# EAGLE design Cartemoteur (EAGLE 9.4.2)
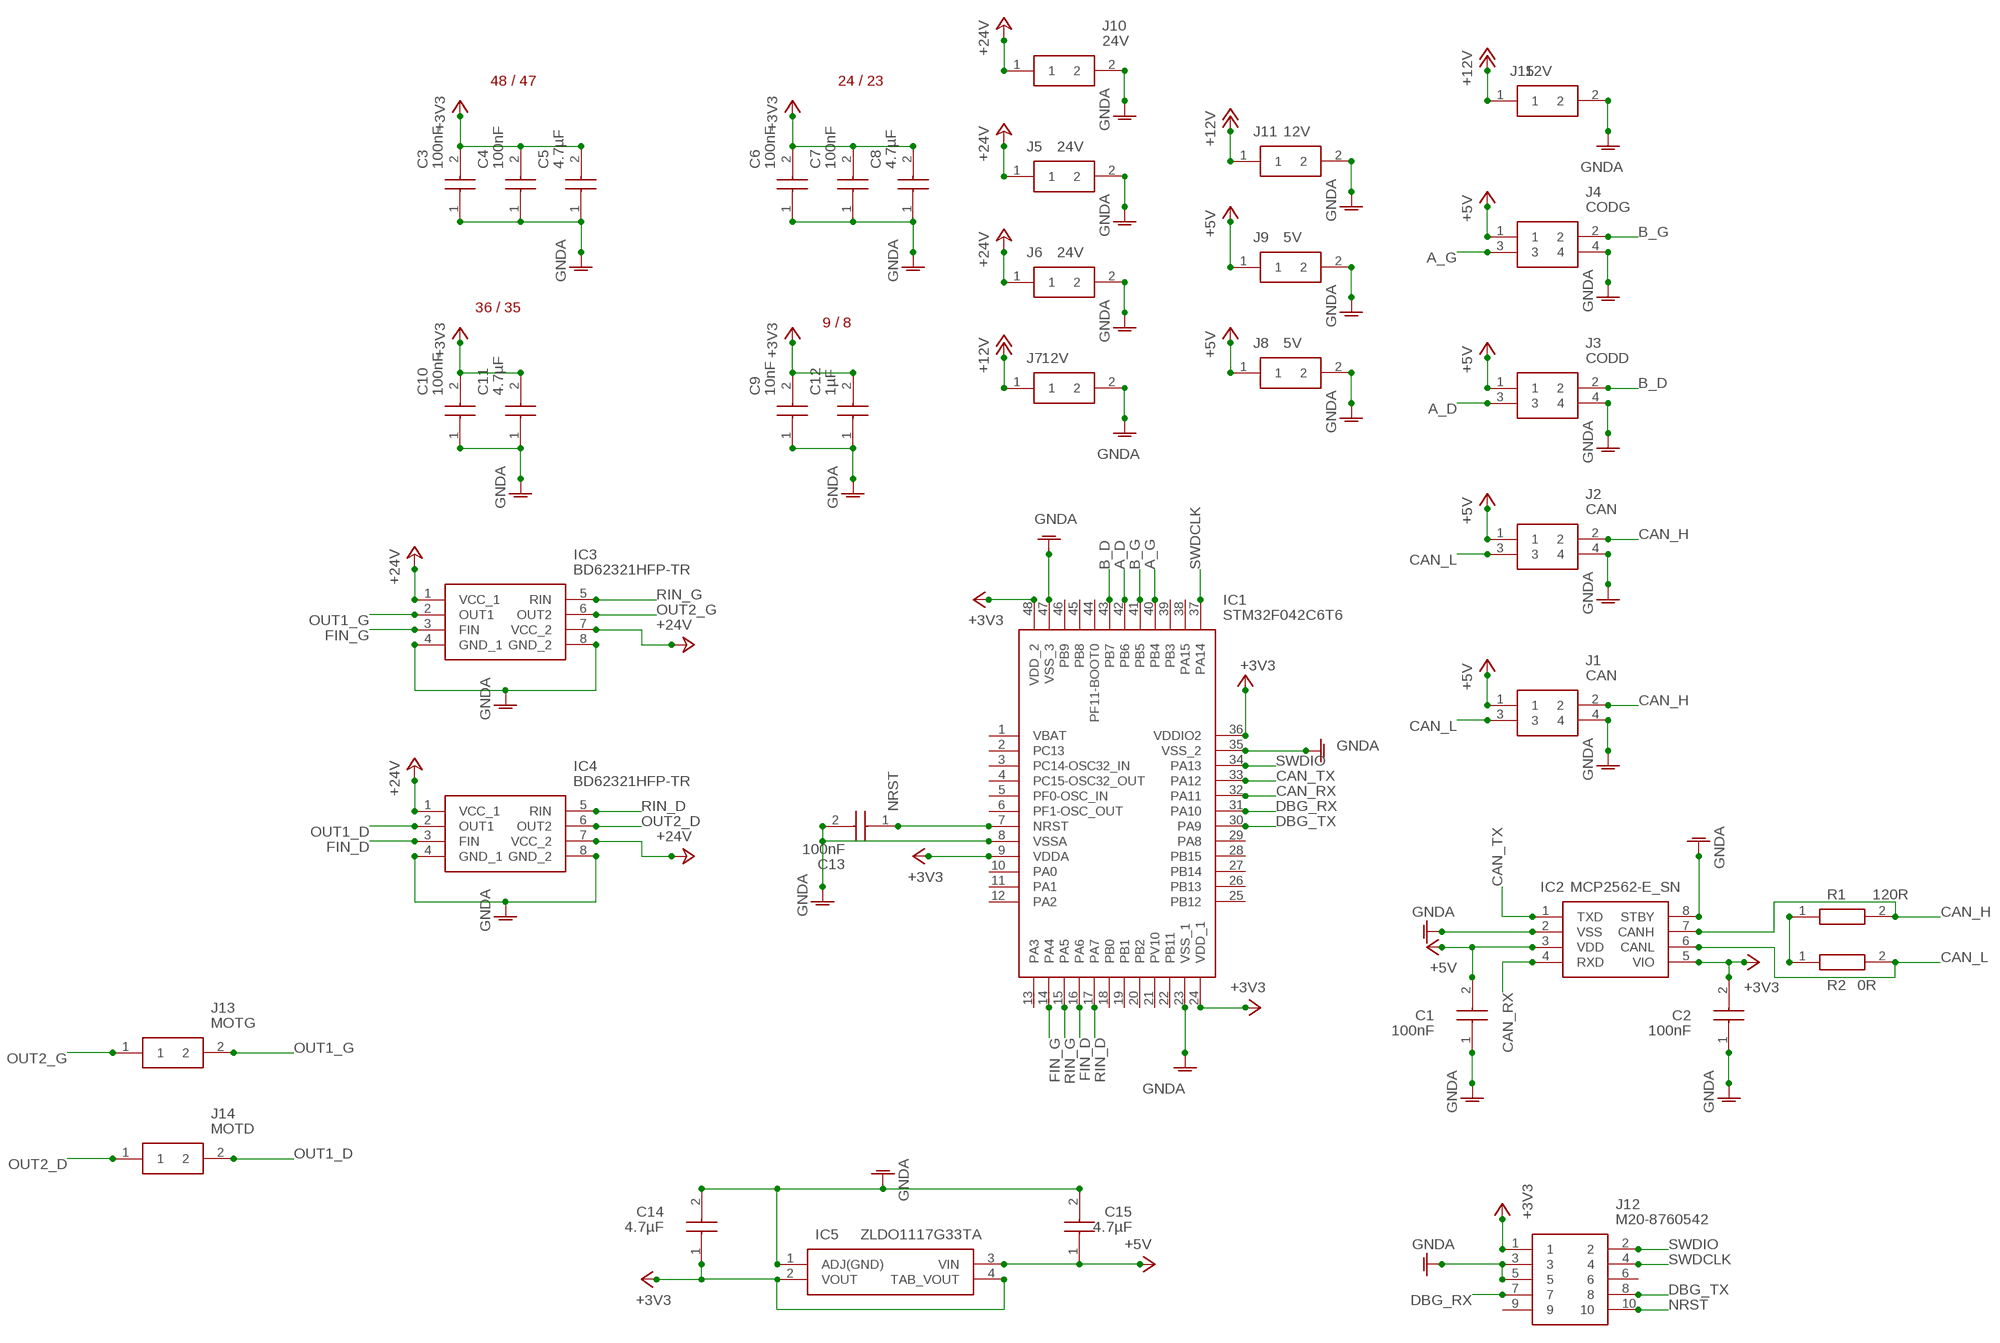
[diagram p0: schematic, sheet 1]

## Parts
C1  100nF  06035C104K4T2A  [CAPC1608X90N]
C2  100nF  06035C104K4T2A  [CAPC1608X90N]
C3  100nF  06035C104K4T2A  [CAPC1608X90N]
C4  100nF  06035C104K4T2A  [CAPC1608X90N]
C5  4.7µF  GRM21BR61E475KA12L  [CAPC2012X145N]
C6  100nF  06035C104K4T2A  [CAPC1608X90N]
C7  100nF  06035C104K4T2A  [CAPC1608X90N]
C8  4.7µF  GRM21BR61E475KA12L  [CAPC2012X145N]
C9  10nF  GRM033R61E103KA12D  [CAPC0603X33N]
C10  100nF  06035C104K4T2A  [CAPC1608X90N]
C11  4.7µF  GRM21BR61E475KA12L  [CAPC2012X145N]
C12  1µF  GRM155B31E105KA12D  [CAPC1005X55N]
C13  100nF  06035C104K4T2A  [CAPC1608X90N]
C14  4.7µF  GRM21BR61E475KA12L  [CAPC2012X145N]
C15  4.7µF  GRM21BR61E475KA12L  [CAPC2012X145N]
IC1  STM32F042C6T6  [QFP50P900X900X160-48N]
IC2  MCP2562-E_SN  [SOIC127P600X175-8N]
IC3  BD62321HFP-TR  [HRP7]
IC4  BD62321HFP-TR  [HRP7]
IC5  ZLDO1117G33TA  [SOT230P700X180-4N]
J1  CAN  43650-0400  [436500400]
J2  CAN  43650-0400  [436500400]
J3  CODD  43650-0400  [436500400]
J4  CODG  43650-0400  [436500400]
J5  24V  43650-0200  [43650-0200]
J6  24V  43650-0200  [43650-0200]
J7  12V  43650-0200  [43650-0200]
J8  5V  43650-0200  [43650-0200]
J9  5V  43650-0200  [43650-0200]
J10  24V  43650-0200  [43650-0200]
J11  12V  43650-0200  [43650-0200]
J12  M20-8760542  [M208760542]
J13  MOTG  43650-0200  [43650-0200]
J14  MOTD  43650-0200  [43650-0200]
J15  12V  43650-0200  [43650-0200]
R1  120R  CRCW0603120RFKEA  [RESC1608X50N]
R2  0R  RK73Z1JTTDB  [RESC1608X55N]

## Nets
+3V3: C2.2 C3.2 C4.2 C5.2 C6.2 C7.2 C8.2 C9.2 C10.2 C11.2 C12.2 C14.1 IC1.9(VDDA) IC1.24(VDD_1) IC1.36(VDDIO2) IC1.48(VDD_2) IC2.5(VIO) IC5.2(VOUT) IC5.4(TAB_VOUT) J12.1
+5V: C1.2 C15.1 IC2.3(VDD) IC5.3(VIN) J1.1 J2.1 J3.1 J4.1 J8.1 J9.1
+12V: J7.1 J11.1 J15.1
+24V: IC3.1(VCC_1) IC3.7(VCC_2) IC4.1(VCC_1) IC4.7(VCC_2) J5.1 J6.1 J10.1
A_D: IC1.42(PB6) J3.3
A_G: IC1.40(PB4) J4.3
B_D: IC1.43(PB7) J3.2
B_G: IC1.41(PB5) J4.2
CAN_H: IC2.7(CANH) J1.2 J2.2 R1.2
CAN_L: IC2.6(CANL) J1.3 J2.3 R2.2
CAN_RX: IC1.32(PA11) IC2.4(RXD)
CAN_TX: IC1.33(PA12) IC2.1(TXD)
DBG_RX: IC1.31(PA10) J12.7
DBG_TX: IC1.30(PA9) J12.8
FIN_D: IC1.16(PA6) IC4.3(FIN)
FIN_G: IC1.14(PA4) IC3.3(FIN)
GNDA: C1.1 C2.1 C3.1 C4.1 C5.1 C6.1 C7.1 C8.1 C9.1 C10.1 C11.1 C12.1 C13.2 C14.2 C15.2 IC1.8(VSSA) IC1.23(VSS_1) IC1.35(VSS_2) IC1.47(VSS_3) IC2.2(VSS) IC2.8(STBY) IC3.4(GND_1) IC3.8(GND_2) IC4.4(GND_1) IC4.8(GND_2) IC5.1(ADJ(GND)) J1.4 J2.4 J3.4 J4.4 J5.2 J6.2 J7.2 J8.2 J9.2 J10.2 J11.2 J12.3 J12.5 J15.2
N$35: R1.1 R2.1
NRST: C13.1 IC1.7(NRST) J12.10
OUT1_D: IC4.2(OUT1) J14.2
OUT1_G: IC3.2(OUT1) J13.2
OUT2_D: IC4.6(OUT2) J14.1
OUT2_G: IC3.6(OUT2) J13.1
RIN_D: IC1.17(PA7) IC4.5(RIN)
RIN_G: IC1.15(PA5) IC3.5(RIN)
SWDCLK: IC1.37(PA14) J12.4
SWDIO: IC1.34(PA13) J12.2
Unconnected: IC1.1(VBAT) IC1.2(PC13) IC1.3(PC14-OSC32_IN) IC1.4(PC15-OSC32_OUT) IC1.5(PF0-OSC_IN) IC1.6(PF1-OSC_OUT) IC1.10(PA0) IC1.11(PA1) IC1.12(PA2) IC1.13(PA3) IC1.18(PB0) IC1.19(PB1) IC1.20(PB2) IC1.21(PV10) IC1.22(PB11) IC1.25(PB12) IC1.26(PB13) IC1.27(PB14) IC1.28(PB15) IC1.29(PA8) IC1.38(PA15) IC1.39(PB3) IC1.44(PF11-BOOT0) IC1.45(PB8) IC1.46(PB9) J12.6 J12.9

## Notes on the sheet
- 48 / 47 | 24 / 23
- 36 / 35
- 9 / 8

## Library data of the parts
C1-C4 C6 C7 C10 C13 = OUTech:06035C104K4T2A: Condo 100nF Source: Datasheet <http://www.mouser.com/catalog/supplier/library/pdf/AVXSurfaceMountCeramic.pdf>; ALLIED_NUMBER: 70474421; ALLIED_PRICE-STOCK: https://www.alliedelec.com/avx-06035c104k4t2a/70474421/; DESCRIPTION: AVX 100nF +/-10% 50 V dc X7R Dielectric SMD Ceramic Multilayer Capacitor 0603; HEIGHT: 0.9mm; MANUFACTURER_NAME: AVX; MANUFACTURER_PART_NUMBER: 06035C104K4T2A; MOUSER_PART_NUMBER: 581-06035C104K4; MOUSER_PRICE-STOCK: https://www.mouser.com/Search/Refine.aspx?Keyword=581-06035C104K4; RS_PART_NUMBER: 6983251P; RS_PRICE-STOCK: http://uk.rs-online.com/web/p/products/6983251P
C5 C8 C11 C14 C15 = OUTech:GRM21BR61E475KA12L: CONDO 4.7 µF Source: Datasheet <http://www.murata.com/~/media/webrenewal/support/library/catalog/products/capacitor/mlcc/c02e.pdf>; DESCRIPTION: MURATA - GRM21BR61E475KA12L - CAP, MLCC, X5R, 4.7UF, 25V, 0805; HEIGHT: 1.45mm; MANUFACTURER_NAME: Murata Electronics; MANUFACTURER_PART_NUMBER: GRM21BR61E475KA12L; MOUSER_PART_NUMBER: 81-GRM21BR61E475KA12; MOUSER_PRICE-STOCK: https://www.mouser.com/Search/Refine.aspx?Keyword=81-GRM21BR61E475KA12; RS_PART_NUMBER: 7236057; RS_PRICE-STOCK: https://uk.rs-online.com/web/p/products/7236057
C9 = OUTech:GRM033R61E103KA12D: Condo 10 nF Source: Datasheet <http://www.murata.com/~/media/webrenewal/support/library/catalog/products/capacitor/mlcc/c02e.pdf>; DESCRIPTION: Multilayer Ceramic Capacitors MLCC - SMD/SMT 0201 0.01uF 25volts *Derate Voltage/Temp; HEIGHT: 0.33mm; MANUFACTURER_NAME: Murata Electronics; MANUFACTURER_PART_NUMBER: GRM033R61E103KA12D; MOUSER_PART_NUMBER: 81-GRM033R61E103KA2D; MOUSER_PRICE-STOCK: https://www.mouser.com/Search/Refine.aspx?Keyword=81-GRM033R61E103KA2D; RS_PART_NUMBER: 8200661; RS_PRICE-STOCK: https://uk.rs-online.com/web/p/products/8200661
C12 = OUTech:GRM155B31E105KA12D: Condo 1 µF Source: Datasheet <http://www.murata.com/~/media/webrenewal/support/library/catalog/products/capacitor/mlcc/c02e.pdf>; DESCRIPTION: Capacitor MLCC GRM 0402 25V 1uF Murata 1005 GRM 1000nF Ceramic Multilayer Capacitor, 25 V dc, +85C, B Dielectric, +/-10%; HEIGHT: 0.55mm; MANUFACTURER_NAME: Murata Electronics; MANUFACTURER_PART_NUMBER: GRM155B31E105KA12D; RS_PART_NUMBER: 8847071P; RS_PRICE-STOCK: http://uk.rs-online.com/web/p/products/8847071P
IC1 = OUTech:STM32F042C6T6: STM32F042C6T6,48-Pin LQFP Source: Datasheet <http://www.st.com/content/ccc/resource/technical/document/datasheet/52/ad/d0/80/e6/be/40/ad/DM00105814.pdf/files/DM00105814.pdf/jcr:content/translations/en.DM00105814.pdf>; DESCRIPTION: STMicroelectronics STM32F042C6T6, 32bit ARM Cortex M0 Microcontroller, 48MHz, 32 kB Flash, 48-Pin LQFP; HEIGHT: 1.6mm; MANUFACTURER_NAME: STMicroelectronics; MANUFACTURER_PART_NUMBER: STM32F042C6T6; MOUSER_PART_NUMBER: 511-STM32F042C6T6; MOUSER_PRICE-STOCK: https://www.mouser.com/Search/Refine.aspx?Keyword=511-STM32F042C6T6; RS_PART_NUMBER: 1106612P; RS_PRICE-STOCK: http://uk.rs-online.com/web/p/products/1106612P
IC2 = OUTech:MCP2562-E_SN: CAN Transceiver Source: Datasheet <http://docs-emea.rs-online.com/webdocs/12a8/0900766b812a88df.pdf>; ALLIED_NUMBER: 70415107; ALLIED_PRICE-STOCK: http://www.alliedelec.com/microchip-technology-inc-mcp2562-e-sn/70415107/; DESCRIPTION: CAN Transceiver 1Mbps 5V 125degC SOIC8 CAN Transceiver 1MBps IEC 61000-4-2 Standby-Mode 8pins SOIC; HEIGHT: 1.75mm; MANUFACTURER_NAME: Microchip; MANUFACTURER_PART_NUMBER: MCP2562-E/SN; MOUSER_PART_NUMBER: 579-MCP2562-E/SN; MOUSER_PRICE-STOCK: https://www.mouser.com/Search/Refine.aspx?Keyword=579-MCP2562-E%2FSN; RS_PART_NUMBER: 7990228P; RS_PRICE-STOCK: http://uk.rs-online.com/web/p/products/7990228P
IC3 IC4 = OUTech:BD62321HFP-TR: Pont H Source: Datasheet <http://rohmfs.rohm.com/en/products/databook/datasheet/ic/motor/dc/bd62321hfp-e.pdf>; DESCRIPTION: H-Bridge motor driver,36V,3A,HRP7 ROHM BD62321HFP-TR Full Bridge Motor Driver 3A, 7-Pin HRP7; HEIGHT: mm; MANUFACTURER_NAME: ROHM Semiconductor; MANUFACTURER_PART_NUMBER: BD62321HFP-TR; MOUSER_PART_NUMBER: 755-BD62321HFP-TR; MOUSER_PRICE-STOCK: https://www.mouser.com/Search/Refine.aspx?Keyword=755-BD62321HFP-TR; RS_PART_NUMBER: 1246483P; RS_PRICE-STOCK: http://uk.rs-online.com/web/p/products/1246483P
IC5 = OUTech:ZLDO1117G33TA: LDO Regulator Pos 3.3V 1A Source: Datasheet <http://docs-emea.rs-online.com/webdocs/13ed/0900766b813ed062.pdf>; ALLIED_NUMBER: 70438621; ALLIED_PRICE-STOCK: http://www.alliedelec.com/diodes-inc-zldo1117g33ta/70438621/; DESCRIPTION: LDO Regulator Pos 3.3V 1A 4Pin SOT223 Diodes Inc ZLDO1117G33TA, Single Linear Voltage Regulator, 1A 3.3 V, 2%, 3-Pin SOT-223; HEIGHT: 1.8mm; MANUFACTURER_NAME: Diodes Inc.; MANUFACTURER_PART_NUMBER: ZLDO1117G33TA; MOUSER_PART_NUMBER: 522-ZLDO1117G33TA; MOUSER_PRICE-STOCK: https://www.mouser.com/Search/Refine.aspx?Keyword=522-ZLDO1117G33TA; RS_PART_NUMBER: 7515183P; RS_PRICE-STOCK: http://uk.rs-online.com/web/p/products/7515183P
J1-J4 = OUTech:43650-0400: MOLEX 4 Pins Source: Datasheet <https://www.molex.com/pdm_docs/sd/436500400_sd.pdf>; ALLIED_NUMBER: 70266896; ALLIED_PRICE-STOCK: https://www.alliedelec.com/molex-incorporated-43650-0400/70266896/; DESCRIPTION: Molex MICRO-FIT 3.0 Series, Series Number 43650, 3mm Pitch 4 Way 1 Row Right Angle PCB Header, Solder Termination, 5A; HEIGHT: mm; MANUFACTURER_NAME: Molex; MANUFACTURER_PART_NUMBER: 43650-0400; MOUSER_PART_NUMBER: 538-43650-0400; MOUSER_PRICE-STOCK: https://www.mouser.com/Search/Refine.aspx?Keyword=538-43650-0400; RS_PART_NUMBER: 6704733P; RS_PRICE-STOCK: http://uk.rs-online.com/web/p/products/6704733P
J5-J11 J13-J15 = OUTech:43650-0200: Molex 2 Pins Source: Datasheet <http://www.molex.com/pdm_docs/sd/436500200_sd.pdf>; ALLIED_NUMBER: 70090939; ALLIED_PRICE-STOCK: https://www.alliedelec.com/molex-incorporated-43650-0200/70090939/; DESCRIPTION: Header 3.00mm, WTB single row, RA, 2w Molex MICRO-FIT 3.0 Series, Series Number 43650, 3mm Pitch 2 Way 1 Row Shrouded Right Angle PCB Header, Through Hole; HEIGHT: mm; MANUFACTURER_NAME: Molex; MANUFACTURER_PART_NUMBER: 43650-0200; MOUSER_PART_NUMBER: 538-43650-0200; MOUSER_PRICE-STOCK: https://www.mouser.com/Search/Refine.aspx?Keyword=538-43650-0200; RS_PART_NUMBER: 6704698P; RS_PRICE-STOCK: http://uk.rs-online.com/web/p/products/6704698P
J12 = OUTech:M20-8760542: PINHEADER 2x5 2.54mm Source: Datasheet <https://cdn.harwin.com/pdfs/M20-876.pdf>; ALLIED_NUMBER: R1052685; ALLIED_PRICE-STOCK: https://www.alliedelec.com/harwin-m20-8760542/R1052685/; DESCRIPTION: M20 Header, Smt, Dil, Vertical, 5+5 W HARWIN M20 Series, 2.54mm Pitch 10 Way 2 Row Straight Pin Header, Surface Mount, Solder Termination; HEIGHT: 8mm; MANUFACTURER_NAME: HARWIN; MANUFACTURER_PART_NUMBER: M20-8760542; MOUSER_PART_NUMBER: 855-M20-8760542; MOUSER_PRICE-STOCK: https://www.mouser.com/Search/Refine.aspx?Keyword=855-M20-8760542; RS_PART_NUMBER: 6812893P; RS_PRICE-STOCK: http://uk.rs-online.com/web/p/products/6812893P
R1 = OUTech:CRCW0603120RFKEA: R 120 OHM Source: Datasheet <http://www.vishay.com/docs/20035/dcrcwe3.pdf>; ALLIED_NUMBER: 70202999; ALLIED_PRICE-STOCK: https://www.alliedelec.com/vishay-dale-crcw0603120rfkea/70202999/; DESCRIPTION: Vishay CRCW Series Thick Film Surface Mount Resistor 0603 Case 120 +/-1% 0.1W +/-100ppm/C; HEIGHT: 0.5mm; MANUFACTURER_NAME: Vishay; MANUFACTURER_PART_NUMBER: CRCW0603120RFKEA; MOUSER_PART_NUMBER: 71-CRCW0603-120-E3; MOUSER_PRICE-STOCK: https://www.mouser.com/Search/Refine.aspx?Keyword=71-CRCW0603-120-E3; RS_PART_NUMBER: 6789718; RS_PRICE-STOCK: https://uk.rs-online.com/web/p/products/6789718
R2 = OUTech:RK73Z1JTTDB: Res 0 Ohm Source: Datasheet <http://static6.arrow.com/aropdfconversion/bc0756cd0a8dcf3d2a21f52543f9dcb6175ffe2d/rk73z.pdf>; DESCRIPTION: Res Thick Film 0603 0 Ohm Pad SMD Automotive T/R; HEIGHT: 0.55mm; MANUFACTURER_NAME: KOA Speer; MANUFACTURER_PART_NUMBER: RK73Z1JTTDB

## Board
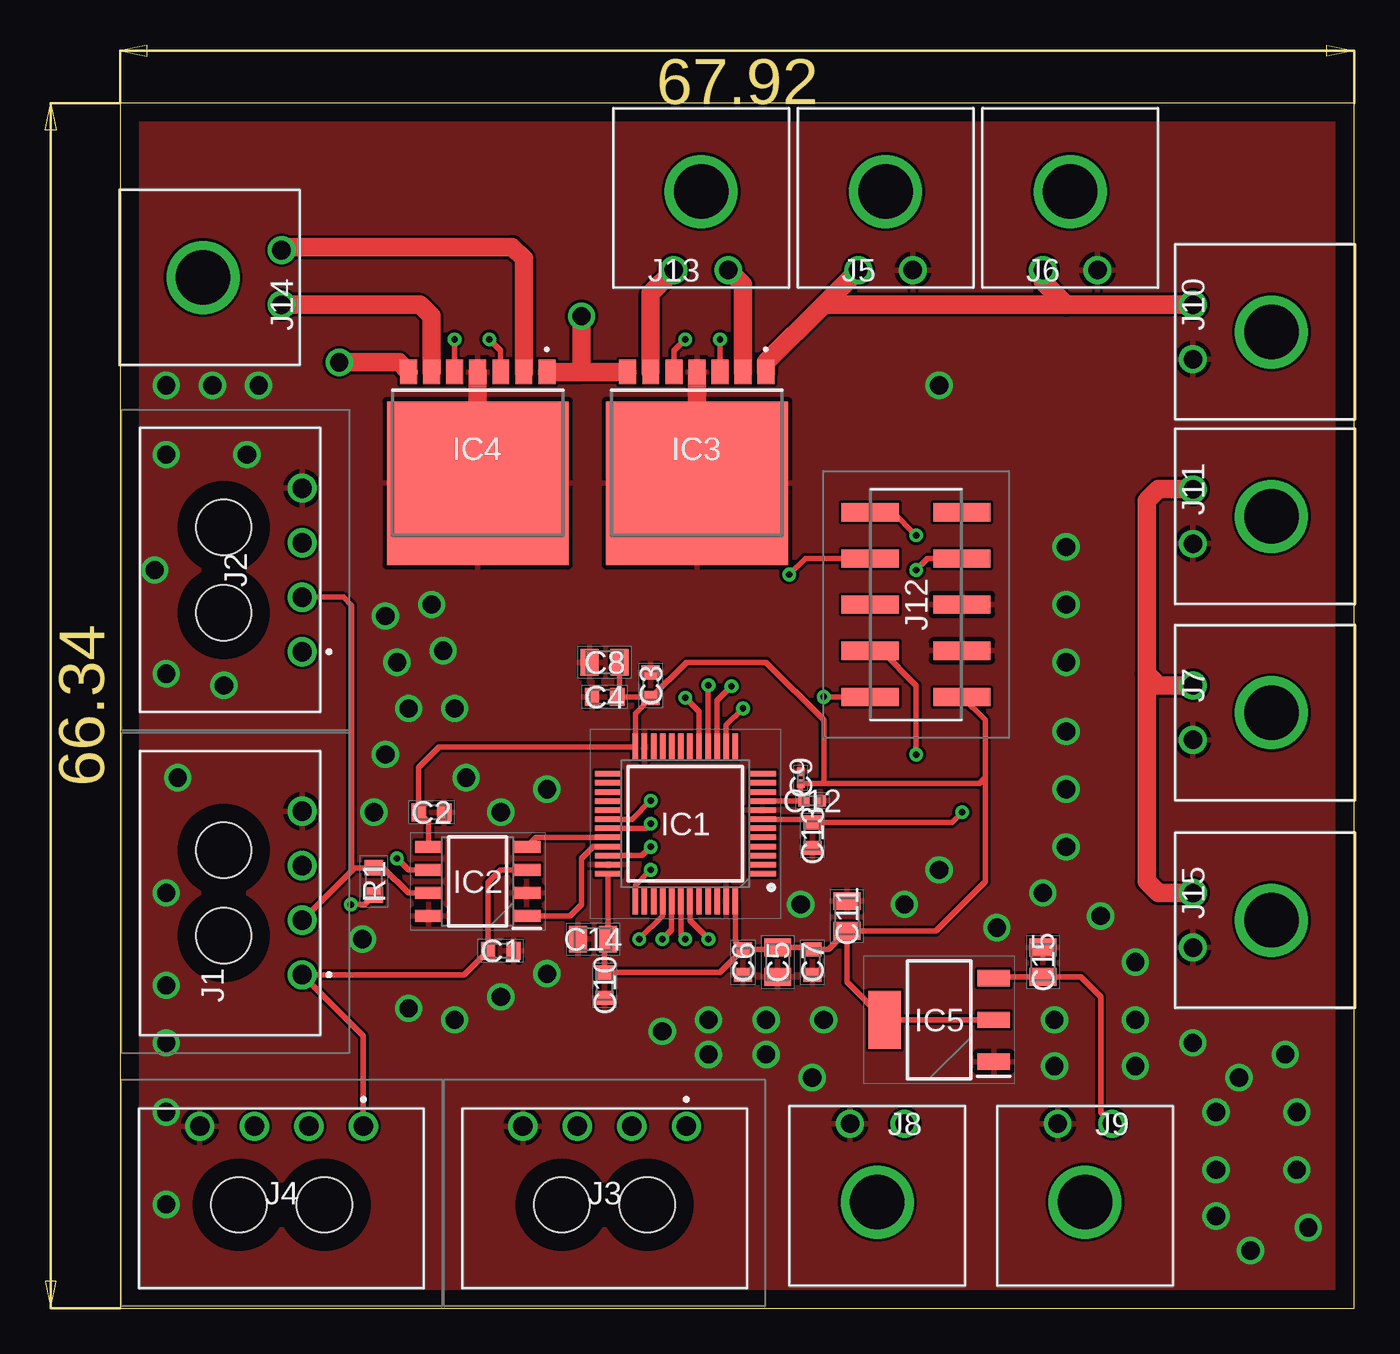
[diagram p1: board, top side]
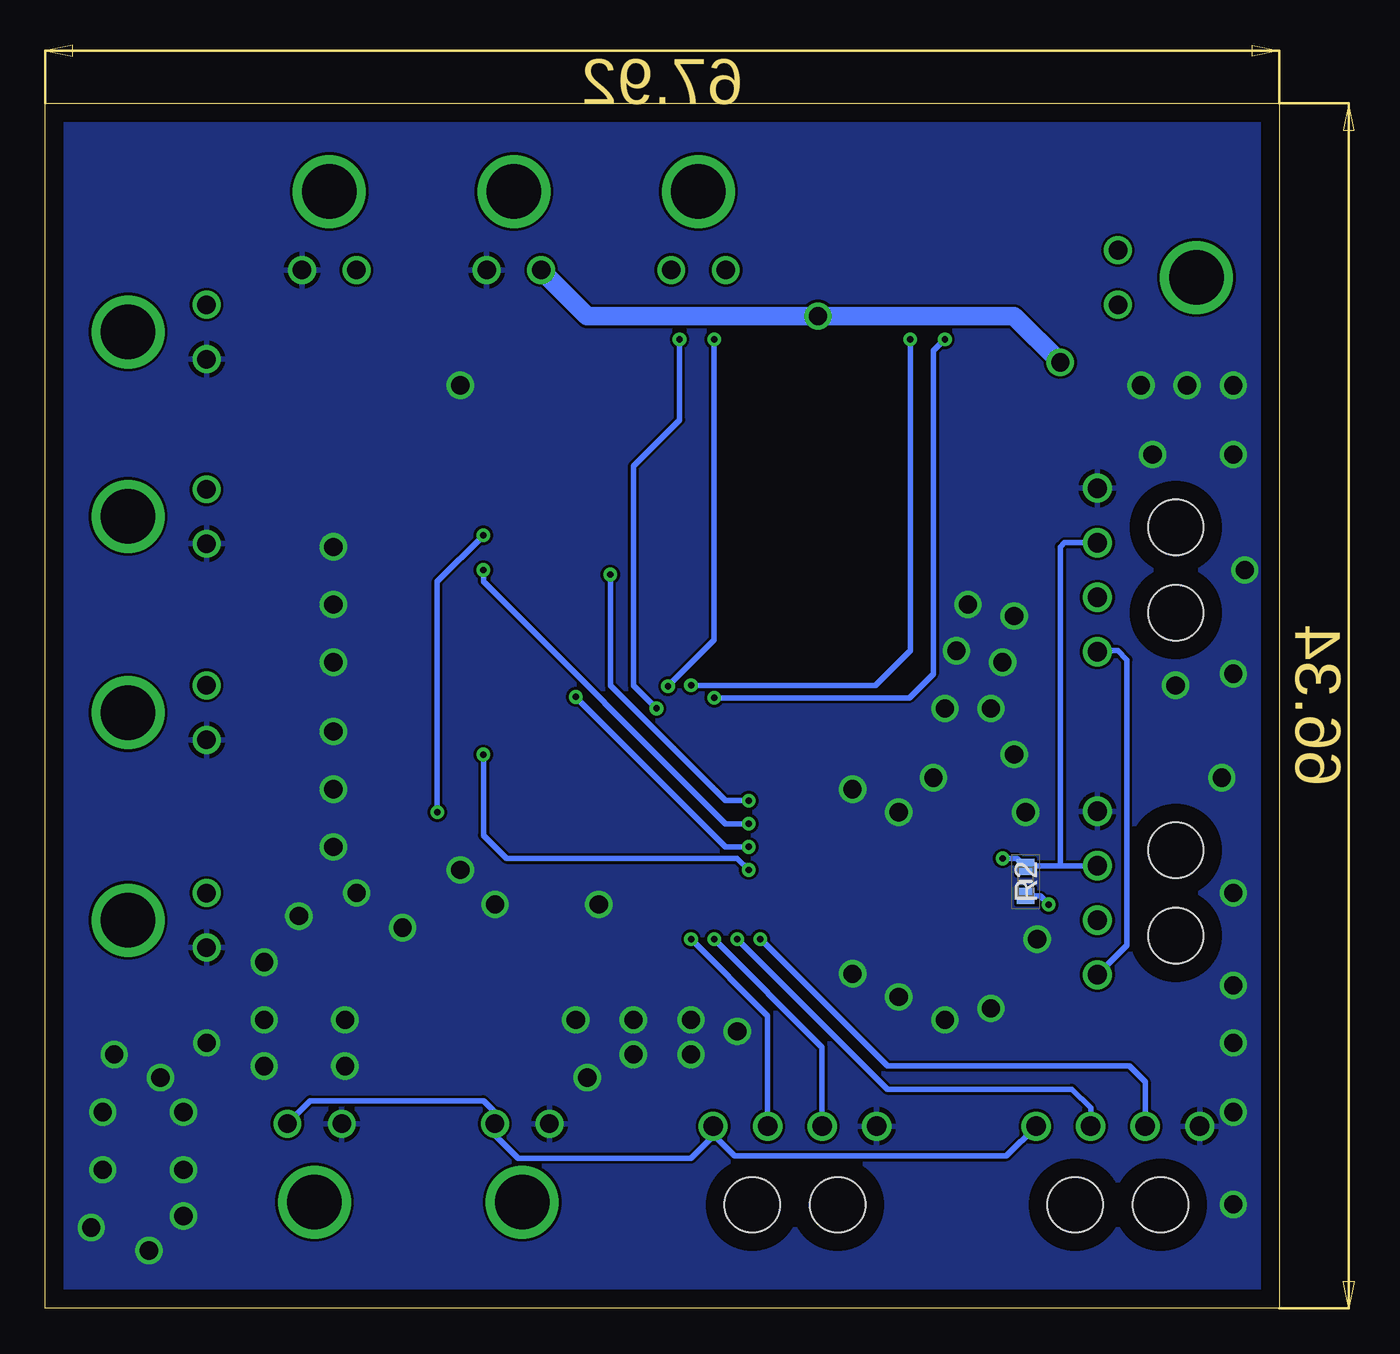
[diagram p2: board, bottom side, seen from below]

Size 67.92 x 66.34 mm. Coordinates in mm from the lower left corner, seen from the top.
Outline: 0,0 67.92,0 67.92,66.34 0,66.34 0,0
Copper layers (1*16): Top 0.035mm / dielectric 1.5mm / Bottom 0.035mm
Design rules "default": minimum track width 6mil, minimum drill 0.35mm, track to track 6mil, track to pad 6mil, pad to pad 6mil, via to via 6mil, smd to smd 6mil, copper to edge 40mil, drill to drill 6mil, minimum pad ring 10mil, minimum via ring 8mil, stop-mask expansion 4mil, vias tented up to drill 0mil, thermal gap 10mil

### Footprints (pad centres in the part's own frame; a part is rotated, then mirrored left to right if it is on the bottom)
CAPC1608X90N = smd 0.78 x 0.99: 1 -0.7,0; 2 0.7,0
CAPC2012X145N = smd 0.99 x 1.47: 1 -0.82,0; 2 0.82,0
CAPC0603X33N = smd 0.46 x 0.42: 1 -0.33,0; 2 0.33,0
CAPC1005X55N = smd 0.6 x 0.62: 1 -0.46,0; 2 0.46,0
QFP50P900X900X160-48N = smd 1.475 x 0.3: 1 -4.238,2.75; 2 -4.238,2.25; 3 -4.238,1.75; 4 -4.238,1.25; 5 -4.238,0.75; 6 -4.238,0.25; 7 -4.238,-0.25; 8 -4.238,-0.75; 9 -4.238,-1.25; 10 -4.238,-1.75; 11 -4.238,-2.25; 12 -4.238,-2.75; 25 4.238,-2.75; 26 4.238,-2.25; 27 4.238,-1.75; 28 4.238,-1.25; 29 4.238,-0.75; 30 4.238,-0.25; 31 4.238,0.25; 32 4.238,0.75; 33 4.238,1.25; 34 4.238,1.75; 35 4.238,2.25; 36 4.238,2.75 | smd 0.3 x 1.475: 13 -2.75,-4.238; 14 -2.25,-4.238; 15 -1.75,-4.238; 16 -1.25,-4.238; 17 -0.75,-4.238; 18 -0.25,-4.238; 19 0.25,-4.238; 20 0.75,-4.238; 21 1.25,-4.238; 22 1.75,-4.238; 23 2.25,-4.238; 24 2.75,-4.238; 37 2.75,4.238; 38 2.25,4.238; 39 1.75,4.238; 40 1.25,4.238; 41 0.75,4.238; 42 0.25,4.238; 43 -0.25,4.238; 44 -0.75,4.238; 45 -1.25,4.238; 46 -1.75,4.238; 47 -2.25,4.238; 48 -2.75,4.238
SOIC127P600X175-8N = smd 1.5 x 0.65: 1 -2.7,1.905; 2 -2.7,0.635; 3 -2.7,-0.635; 4 -2.7,-1.905; 5 2.7,-1.905; 6 2.7,-0.635; 7 2.7,0.635; 8 2.7,1.905
HRP7 = smd 0.93 x 1.37: 1 -3.81,-9; 2 -2.54,-9; 3 -1.27,-9; 4 0,-9; 5 1.27,-9; 6 2.54,-9; 7 3.81,-9 | smd 10 x 9: 8 0,-2.875
SOT230P700X180-4N = smd 1.8 x 0.9: 1 -3,2.3; 2 -3,0; 3 -3,-2.3 | smd 1.8 x 3.2: 4 3,0
436500400 = drill 1.07 pad 1.605: 1 4.5,3.67; 2 1.5,3.67; 3 -1.5,3.67; 4 -4.5,3.67 | hole 3.05: -2.35,-0.65; 2.35,-0.65
43650-0200 = drill 1.02 pad 1.52: 1 0,0; 2 -3,0 | drill 3 pad 3: 3 -1.5,-4.32
M208760542 = smd 1 x 3.15: 1 -5.08,-2.525; 2 -5.08,2.525; 3 -2.54,-2.525; 4 -2.54,2.525; 5 0,-2.525; 6 0,2.525; 7 2.54,-2.525; 8 2.54,2.525; 9 5.08,-2.525; 10 5.08,2.525
RESC1608X50N = smd 0.85 x 1: 1 -0.75,0; 2 0.75,0
RESC1608X55N = smd 0.9 x 0.95: 1 -0.8,0; 2 0.8,0

### Placement (x,y rotation side)
C1  20.95,19.68 180 top
C2  17.14,27.3 180 top
C3  29.21,34.29 270 top
C4  26.67,33.66 0 top
C5  36.2,19.05 90 top
C6  34.29,19.05 90 top
C7  38.1,19.05 90 top
C8  26.67,35.56 0 top
C9  37.47,29.21 270 top
C10  26.67,17.78 90 top
C11  40.01,21.59 270 top
C12  38.1,27.94 180 top
C13  38.1,26.04 270 top
C14  26.04,20.32 180 top
C15  50.8,19.05 90 top
IC1  31.11,26.67 180 top
IC2  19.68,23.5 180 top
IC3  31.75,42.55 180 top
IC4  19.68,42.55 180 top
IC5  45.09,15.88 180 top
J1  6.35,22.86 270 top
J2  6.35,40.64 270 top
J3  26.67,6.35 0 top
J4  8.89,6.35 0 top
J5  40.64,57.15 180 top
J6  50.8,57.15 180 top
J7  59.05,34.29 90 top
J8  43.18,10.16 0 top
J9  54.61,10.16 0 top
J10  59.05,55.24 90 top
J11  59.05,45.09 90 top
J12  43.81,38.73 90 top
J13  30.48,57.15 180 top
J14  8.89,55.24 270 top
J15  59.05,22.86 90 top
R1  13.97,23.5 90 top
R2  13.97,23.5 90 bottom

### Tracks (layer width: path | path; a pad name or v marks a point on that pad's centre or on a via)
+3V3
  Top 0.203: 36.08,19.75 C5.2 | 37.62,27.92 C12.2 | 27.37,35.44 C8.2
  Top 0.305: IC5.2 IC5.4 40.01,17.95 C11.2 | C11.2 38.98,19.75 C7.2 37.98,19.87 C5.2 | C11.2 44.9,20.77 47.62,23.5 47.62,29.21 | 47.62,29.21 47.62,32.37 J12.1 | 47.62,29.21 47.3,28.88 38.73,28.88 | 38.73,28.88 C9.2 37.47,28.11 C12.2 | IC2.5 16.98,26.77 C2.2 16.45,29.78 17.57,30.91 IC1.24 28.36,32.74 C3.2 | IC1.48 33.87,20.18 C6.2 | C6.2 36.08,19.75 | IC1.9 37.62,27.92 | C8.2 27.49,33.77 C4.2 29.14,33.66 C3.2 | C6.2 33.02,18.48 C10.2 26.67,20.14 C14.1 26.86,23.9 IC1.36 | 38.73,28.88 38.73,32.38 35.56,35.56 31.18,35.56 C3.2
+5V
  Top 0.305: J9.1 53.98,10.79 53.98,17.14 52.89,18.23 C15.1 48.14,18.23 IC5.3 | IC2.3 20.95,24.13 20.25,23.43 C1.2 18.93,18.36 J1.1 13.39,14.99 J4.1
  Bottom 0.305: J9.1 53.34,11.43 43.81,11.43 43.18,10.79 J8.1 43.18,9.53 41.91,8.26 32.38,8.26 31.17,9.47 J3.1 31.17,9.58 29.98,8.39 15.02,8.39 J4.1 | J1.1 8.39,19.99 8.39,35.7 8.89,36.2 9.96,36.2 J2.1
+12V
  Top 1.016: J11.1 57.15,45.09 56.52,44.45 56.52,34.92 | 56.52,34.92 57.15,34.29 J7.1 | 56.52,34.92 56.52,23.5 57.15,22.86 J15.1
+24V  (via drill 1)
  Top 1.016: J5.1 38.73,55.24 | 38.73,55.24 35.56,52.07 IC3.1 | IC4.1 25.4,51.55 | IC3.7 25.4,51.55 | v12.06,52.07 15.35,52.07 IC4.7 | J10.1 52.07,55.24 | 52.07,55.24 50.8,56.52 J6.1 | 52.07,55.24 38.73,55.24 | 25.4,51.55 v25.4,54.61
  Bottom 1.016: v12.06,52.07 14.61,54.61 v25.4,54.61 38.1,54.61 J5.1
A_D  (via drill 0.35)
  Top 0.305: IC1.42 30.86,20.57 v31.11,20.32
  Bottom 0.305: v31.11,20.32 25.17,14.38 J3.3
A_G  (via drill 0.35)
  Top 0.305: IC1.40 29.86,21.61 v28.57,20.32
  Bottom 0.305: v28.57,20.32 21.59,13.34 8.26,13.34 7.39,12.47 J4.3
B_D  (via drill 0.35)
  Top 0.305: IC1.43 31.36,21.34 v32.38,20.32
  Bottom 0.305: v32.38,20.32 28.17,16.11 J3.2
B_G  (via drill 0.35)
  Top 0.305: IC1.41 30.36,20.84 v29.84,20.32
  Bottom 0.305: v29.84,20.32 21.59,12.06 11.43,12.06 10.39,11.03 J4.2
CAN_H
  Top 0.305: IC2.7 15.88,22.86 14.49,24.25 R1.2 12.9,24.25 12.74,24.09 | 12.74,24.09 J1.2 | 12.74,24.09 12.74,38.69 12.29,39.14 J2.2
CAN_L  (via drill 0.35)
  Top 0.305: IC2.6 15.88,24.13 v15.24,24.77
  Bottom 0.305: v15.24,24.77 14.44,24.77 R2.2 13.9,24.36 12.06,24.36 | 12.06,24.36 J1.3 10.39,24.36 | J2.3 11.84,42.14 12.06,41.91 12.06,24.36
CAN_RX
  Top 0.305: IC1.32 22.91,25.92 IC2.4
CAN_TX
  Top 0.305: IC1.33 26.05,25.42 25.4,24.77 25.4,22.23 24.77,21.59 IC2.1
DBG_RX  (via drill 0.35)
  Top 0.305: IC1.31 28.96,26.42 v29.21,26.67 | v43.81,40.64 44.45,41.27 J12.7
  Bottom 0.305: v29.21,26.67 30.48,26.67 43.81,40.01 v43.81,40.64
DBG_TX  (via drill 0.35)
  Top 0.305: IC1.30 28.19,26.92 v29.21,27.94 | v36.83,40.39 37.72,41.27 J12.8
  Bottom 0.305: v29.21,27.94 30.48,27.94 36.83,34.29 v36.83,40.39
FIN_D  (via drill 0.35)
  Top 0.305: IC4.3 20.95,52.7 v20.32,53.34 | IC1.16 32.37,34.27 v32.38,34.29
  Bottom 0.305: v32.38,34.29 22.23,34.29 20.32,36.2 v20.32,53.34
FIN_G  (via drill 0.35)
  Top 0.305: IC3.3 v33.02,53.34 | IC1.14 33.37,32.09 v34.29,33.02
  Bottom 0.305: v34.29,33.02 35.56,34.29 35.56,46.35 33.02,48.9 v33.02,53.34
GNDA  (via drill 1)
  Top 1.016: IC4.8 IC4.4 | IC3.8 IC3.4
  other vias: 45.09,50.8 52.07,41.91 52.07,38.73 52.07,35.56 52.07,31.75 52.07,28.57 52.07,25.4 50.8,22.86 48.26,20.95 38.73,15.88 35.56,15.88 32.38,15.88 32.38,13.97 35.56,13.97 38.1,12.7 51.44,13.34 51.44,15.88 55.88,15.88 59.05,14.61 55.88,13.34 60.33,10.79 60.33,7.62 60.33,5.08 62.23,3.17 65.41,4.45 64.77,7.62 64.77,10.79 61.59,12.7 64.14,13.97 55.88,19.05 53.98,21.59 45.09,24.13 43.18,22.23 37.47,22.23 29.84,15.24 23.5,18.41 20.95,17.14 18.41,15.88 15.88,16.51 13.34,20.32 13.97,27.3 14.61,30.48 15.88,33.02 19.05,29.21 20.95,27.3 23.5,28.57 18.41,33.02 17.78,36.2 15.24,35.56 14.61,38.1 17.14,38.73 7.62,50.8 5.08,50.8 2.54,50.8 6.99,46.99 2.54,46.99 2.54,34.92 5.71,34.29 3.17,29.21 1.91,40.64 2.54,22.86 2.54,17.78 2.54,14.61 2.54,10.79 2.54,5.71
  pour Top: 0,0 0,66.04 0.64,66.67 67.94,66.67 67.94,0
  pour Bottom: 0,0 0,66.04 0.64,66.67 67.94,66.67 67.94,0
N$35  (via drill 0.35)
  Top 0.305: R1.1 13.45,22.23 v12.7,22.23
  Bottom 0.305: v12.7,22.23 13.17,22.7 R2.1
NRST  (via drill 0.35)
  Top 0.305: IC1.7 37.91,26.92 C13.1 45.78,26.73 v46.35,27.3 | v43.81,42.55 42.55,43.81 J12.10
  Bottom 0.305: v46.35,27.3 46.35,40.01 v43.81,42.55
OUT1_D
  Top 1.016: J14.2 9.06,58.42 21.59,58.42 22.23,57.78 IC4.2
OUT1_G
  Top 1.016: IC3.2 34.29,56.34 J13.2
OUT2_D
  Top 1.016: IC4.6 17.14,54.61 16.51,55.24 J14.1
OUT2_G
  Top 1.016: IC3.6 29.21,55.88 J13.1
RIN_D  (via drill 0.35)
  Top 0.305: IC4.5 v18.41,53.34 | IC1.17 31.86,32.86 v31.11,33.61
  Bottom 0.305: v18.41,53.34 19.05,52.7 19.05,34.92 20.37,33.61 v31.11,33.61
RIN_G  (via drill 0.35)
  Top 0.305: IC3.5 30.48,52.7 v31.11,53.34 | IC1.15 32.87,33.45 v33.66,34.24
  Bottom 0.305: v31.11,53.34 31.11,36.78 v33.66,34.24
SWDCLK  (via drill 0.35)
  Top 0.305: IC1.37 28.36,23.29 v29.21,24.13 | 42.55,36.2 J12.4 41.91,36.2 43.81,34.29 v43.81,30.48
  Bottom 0.305: v29.21,24.13 29.84,24.77 42.55,24.77 43.81,26.04 v43.81,30.48
SWDIO  (via drill 0.35)
  Top 0.305: IC1.34 28.73,24.92 v29.21,25.4 | v38.73,33.66 J12.2
  Bottom 0.305: v29.21,25.4 30.48,25.4 v38.73,33.66